# Altium schematic sheet Main.SchDoc
size A; SheetNumber: 1; SheetTotal: 5
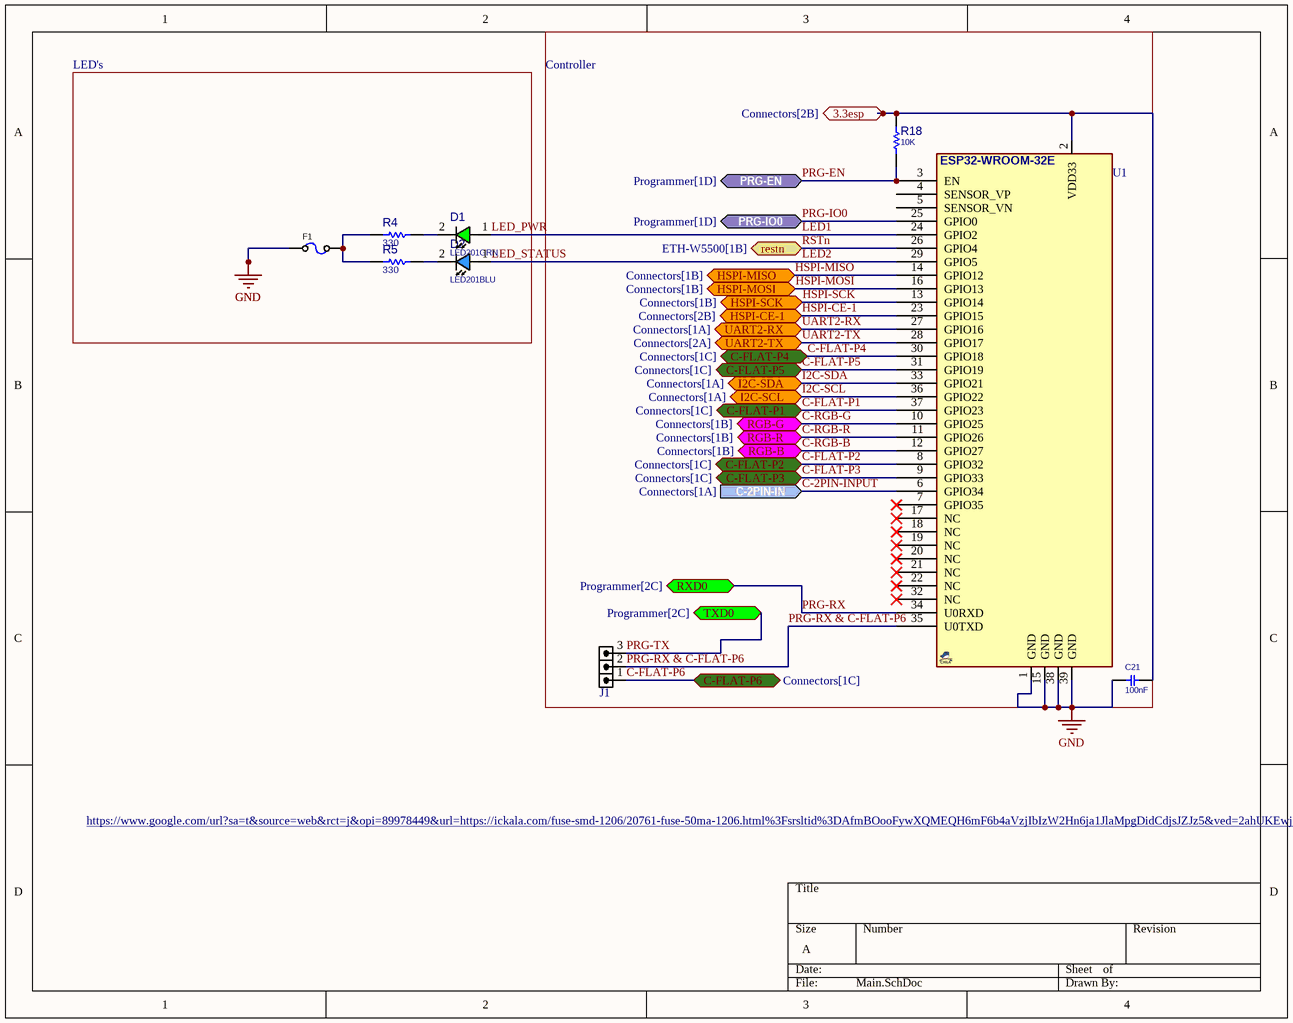
[diagram p0: Main.SchDoc]

## Parts
C21  100nF  [C_CERM_D3]
D1  LED201GRN  [LED0201GRN]
D2  LED201BLU  [LED0201BLU]
F1  (no value)  [F1206]
J1  HDRM3  [HDR_M_1X3]  (value not drawn)
R4  330  [R0402]
R5  330  [R0402]
R18  10K  [R025W_AX04]
U1  ESP32-WROOM-32E  [ESP32S]  (value not drawn)

## Blocks framed on the sheet
LED's: D1 D2 F1 R4 R5
Controller: C21 J1 R18 U1

## Ports
3.3esp (bidir, see Connectors[2B]), C-2PIN-IN (in, see Connectors[1A]), C-FLAT-P1 (bidir, see Connectors[1C]), C-FLAT-P2 (bidir, see Connectors[1C]), C-FLAT-P3 (bidir, see Connectors[1C]), C-FLAT-P4 (bidir, see Connectors[1C]), C-FLAT-P5 (bidir, see Connectors[1C]), C-FLAT-P6 (bidir, see Connectors[1C]), HSPI-CE-1 (bidir, see Connectors[2B]), HSPI-MISO (bidir, see Connectors[1B]), HSPI-MOSI (bidir, see Connectors[1B]), HSPI-SCK (bidir, see Connectors[1B]), I2C-SCL (bidir, see Connectors[1A]), I2C-SDA (bidir, see Connectors[1A]), PRG-EN (bidir, see Programmer[1D]), PRG-IO0 (bidir, see Programmer[1D]), restn (bidir, see ETH-W5500[1B]), RGB-B (bidir, see Connectors[1B]), RGB-G (bidir, see Connectors[1B]), RGB-R (bidir, see Connectors[1B]), RXD0 (bidir, see Programmer[2C]), TXD0 (bidir, see Programmer[2C]), UART2-RX (bidir, see Connectors[1A]), UART2-TX (bidir, see Connectors[2A])

## Nets
GND: C21.1 F1.1 U1.1(GND) U1.15(GND) U1.38(GND) U1.39(GND)
3.3esp: C21.2 R18.2 U1.2(VDD33) ; port 3.3esp
C-2PIN-INPUT: U1.6(GPIO34) ; port C-2PIN-IN
C-FLAT-P1: U1.37(GPIO23) ; port C-FLAT-P1
C-FLAT-P2: U1.8(GPIO32) ; port C-FLAT-P2
C-FLAT-P3: U1.9(GPIO33) ; port C-FLAT-P3
C-FLAT-P4: U1.30(GPIO18) ; port C-FLAT-P4
C-FLAT-P5: U1.31(GPIO19) ; port C-FLAT-P5
C-FLAT-P6: J1.1 ; port C-FLAT-P6
C-RGB-B: U1.12(GPIO27) ; port RGB-B
C-RGB-G: U1.10(GPIO25) ; port RGB-G
C-RGB-R: U1.11(GPIO26) ; port RGB-R
HSPI-CE-1: U1.23(GPIO15) ; port HSPI-CE-1
HSPI-MISO: U1.14(GPIO12) ; port HSPI-MISO
HSPI-MOSI: U1.16(GPIO13) ; port HSPI-MOSI
HSPI-SCK: U1.13(GPIO14) ; port HSPI-SCK
I2C-SCL: U1.36(GPIO22) ; port I2C-SCL
I2C-SDA: U1.33(GPIO21) ; port I2C-SDA
LED1: D1.1(ANODE) U1.24(GPIO2)  [also labelled LED_PWR]
LED2: D2.1(ANODE) U1.29(GPIO5)  [also labelled LED_STATUS]
PRG-EN: R18.1 U1.3(EN) ; port PRG-EN
PRG-IO0: U1.25(GPIO0) ; port PRG-IO0
PRG-RX: U1.34(U0RXD) ; port RXD0
PRG-RX & C-FLAT-P6: J1.2 U1.35(U0TXD)
PRG-TX: J1.3 ; port TXD0
RSTn: U1.26(GPIO4) ; port restn
UART2-RX: U1.27(GPIO16) ; port UART2-RX
UART2-TX: U1.28(GPIO17) ; port UART2-TX
NetD1_2: D1.2(CATHODE) R4.2
NetD2_2: D2.2(CATHODE) R5.2
NetF1_2: F1.2 R4.1 R5.1

Not connected (* = marked no-connect by the designer): U1 4(SENSOR_VP) 5(SENSOR_VN) 7(GPIO35)* 17(NC)* 18(NC)* 19(NC)* 20(NC)* 21(NC)* 22(NC)* 32(NC)*

## Notes on the sheet
- https://www.google.com/url?sa=t&source=web&rct=j&opi=89978449&url=https://ickala.com/fuse-smd-1206/20761-fuse-50ma-1206.html%3Fsrsltid%3DAfmBOooFywXQMEQH6mF6b4aVzjIbIzW2Hn6ja1JlaMpgDidCdjsJZJz5&ved=2ahUKEwjq692gmKuOAxWVVEEAHWFWFJQQFnoECBgQAQ&usg=AOvVaw3Zv6yv8cLdd4ct48txnz0A

## Library data of the parts
C21 = CAP_THD_CER: CAP, THD, CER MULTI LAYER,; DESC: CAP, CER MULTI LAYER,; MANF_P#: MANF_PART#; PARAM2: 50V; PRICE: 100= 1$; MANF: MANF; ASSEMBLY: ASSEMBLY; VALUE: 100nF
D1 = LED_SMD_0201_GRN: LED, SMD, 0201, GREEN; PARAM: 20mA, 570nm, 140° Angle; MANF: Kingbright; DESC: DESCRIPTION; MANF_P#: APG0603CGC; PARAM2: 2V, -40~85°C; ASSEMBLY: ASSEMBLY; PRICE: 0.5$; VALUE: LED201GRN
D2 = LED_SMD_0201_BLU: LED, SMD, 0201, BLUE; PARAM: 5mA, 470nm, 110° Angle; MANF: Lumex; DESC: DESCRIPTION; MANF_P#: SML-LX0201USBC-TR; PARAM2: 2.6V, -40~85°C; ASSEMBLY: ASSEMBLY; PRICE: 0.3$; VALUE: LED201BLU
F1 = FUSE_160mA_1206: Fuse, 160mA, 63VDC, 1206, SMD, Fast Acting; PARAM: 160mA; 63VDC; slow-blow; MANF: Holly Fuse; MANF_P#: 12T-0160L; PARAM2: PARAM2
J1 = HDR_M_1X3: CONN, HEADER, Male, pitch: 2.54mm, 3POS; VALUE: HDRM3
R4 R5 = RES_SMD: RESISTOR, SMD; PARAM: -W; DESC: DESCRIPTION; DIST#: MOUSER; PARAM2: 1%; MANF_P#: -; MANF: -; ASSEMBLY: ASSEMBLY; PRICE: 100= 0.5$; VALUE: 330
R18 = RES_THD: RESISTOR, THD; MANF_P#: RK73H1ETTP4701F; MANF: KOA SPEER; PARAM: 0.063W; DESC: DESCRIPTION; DIST#: MOUSER; PARAM2: 1%; ASSEMBLY: ASSEMBLY; PRICE: 100= 0.5$; VALUE: 10K
U1 = ESP32-WROOM-32E: WiFi with Bluetooth 4.0; MANF_P#: ESP32-WROOM-32E; VALUE: ESP32-WROOM-32E